# EAGLE schematic ASM2027-Rev3 (EAGLE 6.3)
DATABASE: ./../../../../../Components/TinyCircuits_Part_Database.txt
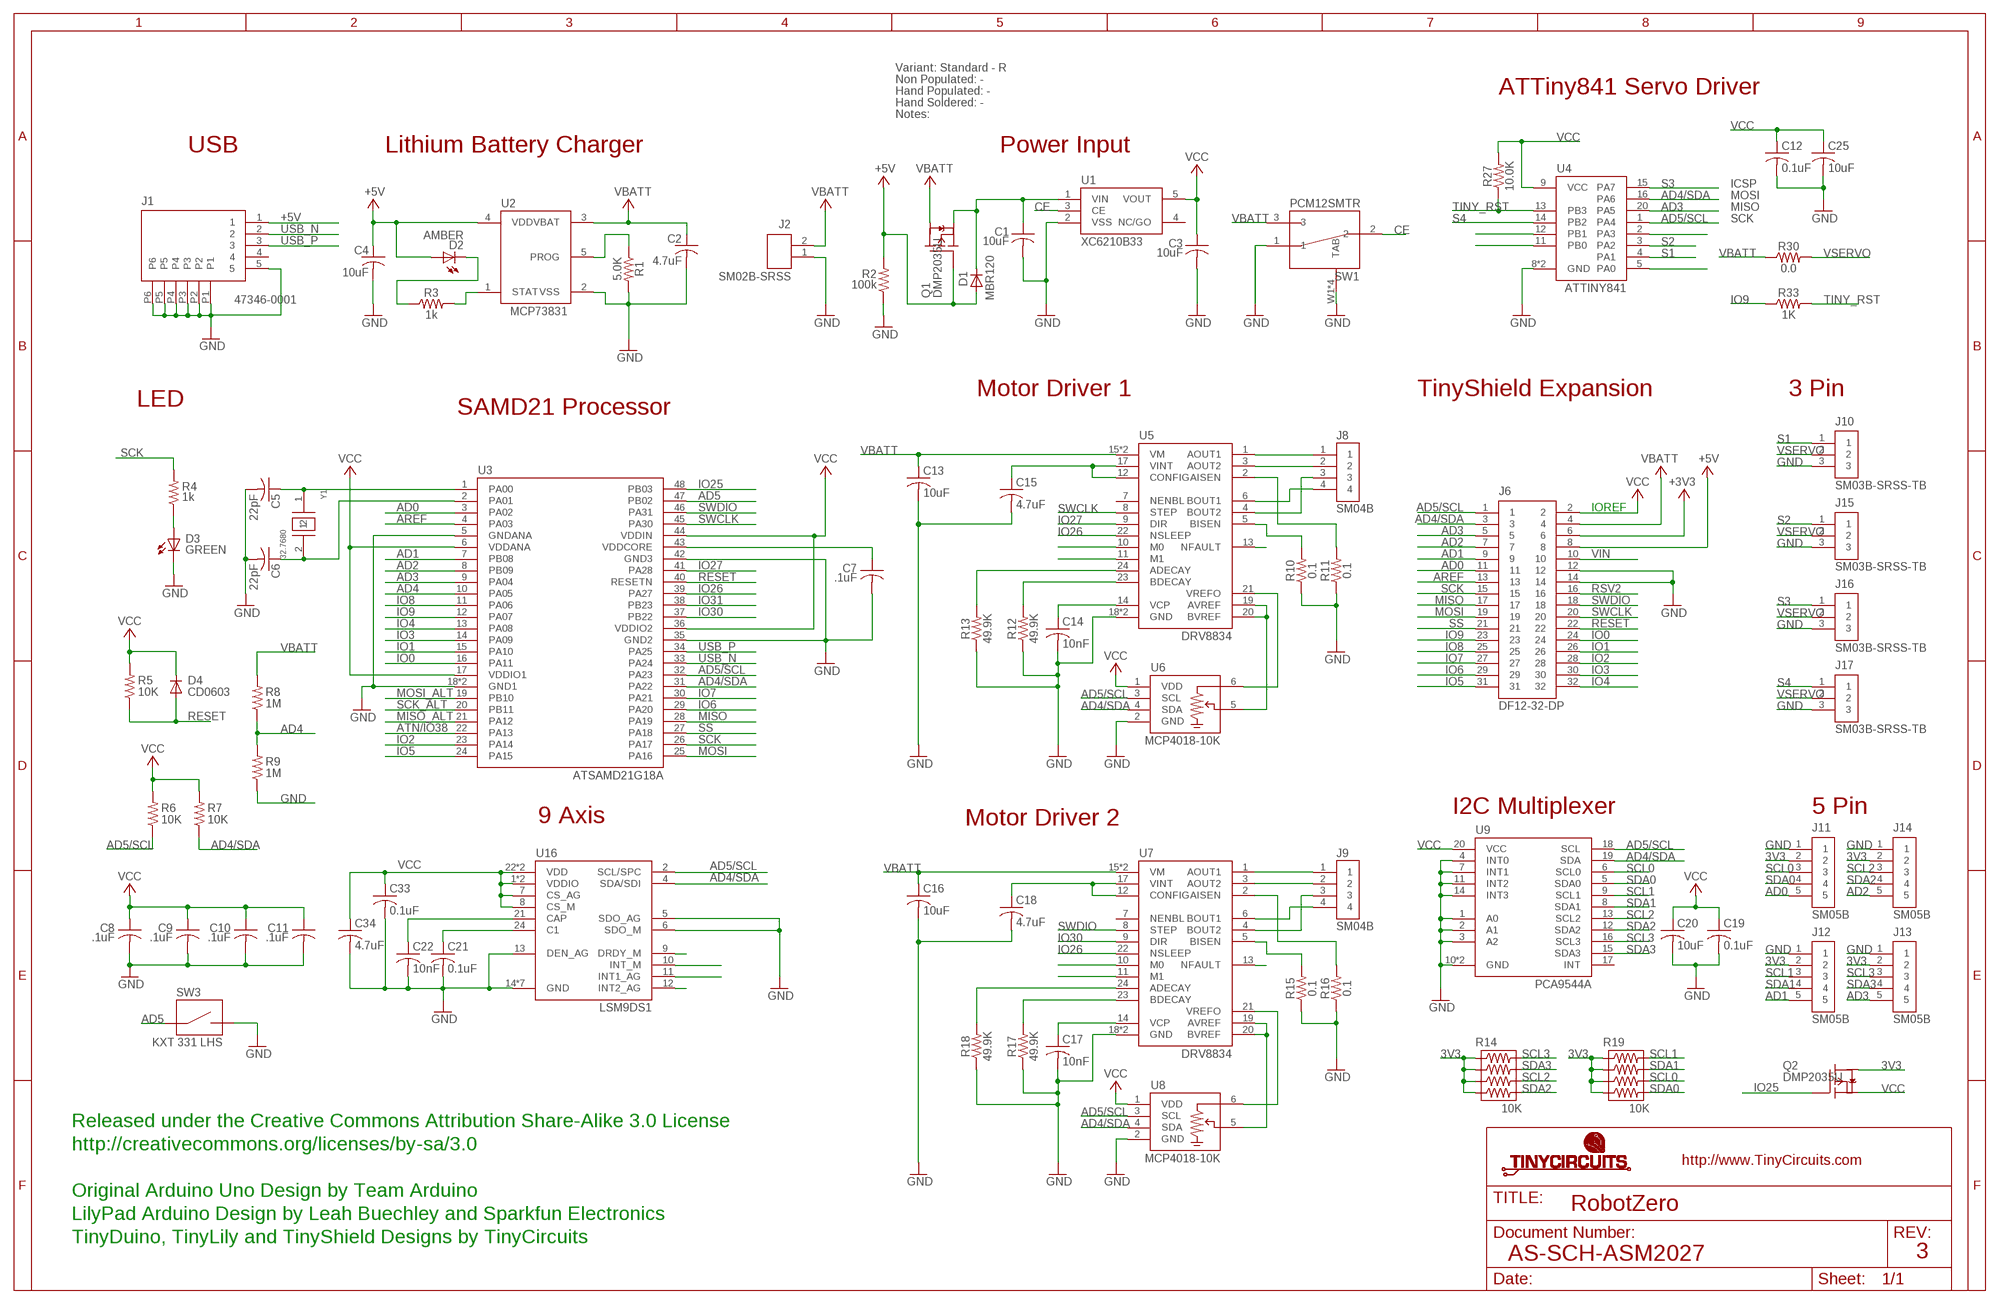
[diagram p0: schematic, sheet 1]

## Parts
C1  10uF  AS-ITM-00002  [C0603]
C2  4.7uF  AS-ITM-00088  [C0603]
C3  10uF  AS-ITM-00002  [C0603]
C4  10uF  AS-ITM-00002  [C0603]
C5  22pF  AS-ITM-00211  [C0402]
C6  22pF  AS-ITM-00211  [C0402]
C7  .1uF  AS-ITM-00008  [C0402]
C8  .1uF  AS-ITM-00008  [C0402]
C9  .1uF  AS-ITM-00008  [C0402]
C10  .1uF  AS-ITM-00008  [C0402]
C11  .1uF  AS-ITM-00008  [C0402]
C12  0.1uF  AS-ITM-00008  [C0402]
C13  10uF  AS-ITM-00002  [C0603]
C14  10nF  AS-ITM-00084  [C0402]
C15  4.7uF  AS-ITM-00242  [C0402]
C16  10uF  AS-ITM-00002  [C0603]
C17  10nF  AS-ITM-00084  [C0402]
C18  4.7uF  AS-ITM-00242  [C0402]
C19  0.1uF  AS-ITM-00008  [C0402]
C20  10uF  AS-ITM-00002  [C0603]
C21  0.1uF  AS-ITM-00008  [C0402]
C22  10nF  AS-ITM-00084  [C0402]
C25  10uF  AS-ITM-00045  [C0805]
C33  0.1uF  AS-ITM-00008  [C0402]
C34  4.7uF  AS-ITM-00242  [C0402]
D1  MBR120  AS-ITM-00111  [SOD-123FL]
D2  AMBER  AS-ITM-00058  [0402_LED]
D3  GREEN  AS-ITM-00011  [LNJ_LED]
D4  CD0603  AS-ITM-00009  [0603]
J1  47346-0001  AS-ITM-00021  [MICRO_USB]
J2  SM02B-SRSS  AS-ITM-00231  [JST_SH_2X1]
J6  DF12-32-DP  AS-ITM-00015  [DF12-32-DP]
J8  SM04B  AS-ITM-00395  [JST_SH_4X1]
J9  SM04B  AS-ITM-00395  [JST_SH_4X1]
J10  SM03B-SRSS-TB  AS-ITM-00471  [JST_SH_3X1_VERT]
J11  SM05B  AS-ITM-00391  [JST_SH_5X1_VERT]
J12  SM05B  AS-ITM-00391  [JST_SH_5X1_VERT]
J13  SM05B  AS-ITM-00391  [JST_SH_5X1_VERT]
J14  SM05B  AS-ITM-00391  [JST_SH_5X1_VERT]
J15  SM03B-SRSS-TB  AS-ITM-00471  [JST_SH_3X1_VERT]
J16  SM03B-SRSS-TB  AS-ITM-00471  [JST_SH_3X1_VERT]
J17  SM03B-SRSS-TB  AS-ITM-00471  [JST_SH_3X1_VERT]
Q1  DMP2035U  AS-ITM-00024A  [SOT23A]
Q2  DMP2035U  AS-ITM-00024A  [SOT23A]
R1  5.0K  AS-ITM-00289  [0402]
R2  100k  AS-ITM-00004  [0402]
R3  1k  AS-ITM-00003  [0402]
R4  1k  AS-ITM-00003  [0402]
R5  10K  AS-ITM-00032  [0402]
R6  10K  AS-ITM-00032  [0402]
R7  10K  AS-ITM-00032  [0402]
R8  1M  AS-ITM-00005  [0402]
R9  1M  AS-ITM-00005  [0402]
R10  0.1  AS-ITM-00157  [R0805]
R11  0.1  AS-ITM-00157  [R0805]
R12  49.9K  AS-ITM-00074  [0402]
R13  49.9K  AS-ITM-00074  [0402]
R14  10K  AS-ITM-00520  [0402RPACK]
R15  0.1  AS-ITM-00157  [R0805]
R16  0.1  AS-ITM-00157  [R0805]
R17  49.9K  AS-ITM-00074  [0402]
R18  49.9K  AS-ITM-00074  [0402]
R19  10K  AS-ITM-00520  [0402RPACK]
R27  10.0K  AS-ITM-00032  [0402]
R30  0.0  AS-ITM-00076  [0402]
R33  1K  AS-ITM-00003  [0402]
SW1  PCM12SMTR  AS-ITM-00220  [PCM12SMTR]
SW3  KXT 331 LHS  AS-ITM-00372  [KXT_LHS]
U1  XC6210B33  AS-ITM-00046  [SOT-25]
U2  MCP73831  AS-ITM-00136  [SOT-23]
U3  ATSAMD21G18A  AS-ITM-00273  [QFN48]
U4  ATTINY841  AS-ITM-00255  [VQFN-20]
U5  DRV8834  AS-ITM-00392  [VQFN-24_4X4]
U6  MCP4018-10K  AS-ITM-00393  [SOT-353-6]
U7  DRV8834  AS-ITM-00392  [VQFN-24_4X4]
U8  MCP4018-10K  AS-ITM-00393  [SOT-353-6]
U9  PCA9544A  AS-ITM-00342  [VQFN-20_4.5X3.5]
U16  LSM9DS1  AS-ITM-00265  [LGA-24]
Y1  32.7680  AS-ITM-00279  [ABS06]

## Nets
3V3: J11.2 J12.2 J13.2 J14.2 Q2.C(D) R14.1 R14.3 R14.5 R14.7 R19.1 R19.3 R19.5 R19.7
+3V3: J6.6
+5V: C4.1 D1.A D2.1(A) J1.1 J6.8 Q1.B(G) R2.2 U2.4(VDD)
AD0: J6.11 J11.5 U3.3(PA02)
AD1: J6.9 J12.5 U3.7(PB08)
AD2: J6.7 J14.5 U3.8(PB09)
AD3: J6.5 J13.5 U3.9(PA04) U4.20(PA5)
AD4: R8.1 R9.2 U3.10(PA05)
AD4/SDA: J6.3 R7.1 U3.31(PA22) U4.16(PA6) U6.4(SDA) U8.4(SDA) U9.19(SDA) U16.4(SDA/SDI)
AD5: SW3.1 U3.47(PB02)
AD5/SCL: J6.1 R6.1 U3.32(PA23) U4.1(PA4) U6.3(SCL) U8.3(SCL) U9.18(SCL) U16.2(SCL/SPC)
AOUT1: J8.1 U5.1(AOUT1)
AOUT2: J8.2 U5.3(AOUT2)
AOUT3: J9.1 U7.1(AOUT1)
AREF: J6.13 U3.4(PA03)
ATN/IO38: U3.22(PA13)
BOUT1: J8.4 U5.6(BOUT1)
BOUT2: J8.3 U5.4(BOUT2)
BOUT3: J9.4 U7.6(BOUT1)
BOUT4: J9.3 U7.4(BOUT2)
CE: SW1.2 U1.3(CE)
GND: C1.2 C2.2 C3.2 C4.2 C5.2 C6.2 C7.2 C8.2 C9.2 C10.2 C11.2 C12.2 C13.2 C14.2 C15.2 C16.2 C17.2 C18.2 C19.2 C20.2 C21.2 C22.2 C25.2 C33.2 C34.2 D3.C J1.5 J1.P1 J1.P2 J1.P3 J1.P4 J1.P5 J1.P6 J2.1 J6.12 J6.14 J10.3 J11.1 J12.1 J13.1 J14.1 J15.3 J16.3 J17.3 R1.2 R2.1 R9.1 R10.1 R11.1 R12.1 R13.1 R15.1 R16.1 R17.1 R18.1 SW1.1 SW1.W1(TAB) SW1.W2(TAB) SW1.W3(TAB) SW1.W4(TAB) SW3.2 U1.2(VSS) U2.2(VSS) U3.5(GNDANA) U3.18(GND1) U3.35(GND2) U3.42(GND3) U3.EXP(GND1) U4.8(GND) U4.PAD(GND) U5.18(GND) U5.PAD(GND) U6.2(GND) U7.18(GND) U7.PAD(GND) U8.2(GND) U9.1(A0) U9.2(A1) U9.3(A2) U9.4(INT0) U9.7(INT1) U9.10(GND) U9.11(INT2) U9.14(INT3) U9.PAD(GND) U16.5(SDO_AG) U16.6(SDO_M) U16.13(DEN_AG) U16.14(GND) U16.15(GND) U16.16(GND) U16.17(GND) U16.18(GND) U16.19(GND) U16.20(GND)
IO0: J6.24 U3.16(PA11)
IO1: J6.26 U3.15(PA10)
IO2: J6.28 U3.23(PA14)
IO3: J6.30 U3.14(PA09)
IO4: J6.32 U3.13(PA08)
IO5: J6.31 U3.24(PA15)
IO6: J6.29 U3.29(PA20)
IO7: J6.27 U3.30(PA21)
IO8: J6.25 U3.11(PA06)
IO9: J6.23 R33.1 U3.12(PA07)
IO25: Q2.B(G) U3.48(PB03)
IO26: U3.39(PA27) U5.22(NSLEEP) U7.22(NSLEEP)
IO27: U3.41(PA28) U5.9(DIR)
IO30: U3.37(PB22) U7.9(DIR)
IO31: U3.38(PB23)
MISO: J6.17 U3.28(PA19)
MISO_ALT: U3.21(PA12)
MOSI: J6.19 U3.25(PA16)
MOSI_ALT: U3.19(PB10)
N$1: C5.1 U3.1(PA00) Y1.1
N$2: U4.11(PB0)
N$3: C6.1 U3.2(PA01) Y1.2
N$4: D3.A R4.1
N$5: D2.2(C) R3.1
N$6: R1.1 U2.5(PROG)
N$7: R3.2 U2.1(STAT)
N$8: C7.1 U3.43(VDDCORE)
N$9: R10.2 U5.5(BISEN)
N$10: R11.2 U5.2(AISEN)
N$11: U5.19(AVREF) U5.20(BVREF) U6.5(W)
N$12: U5.21(VREFO) U6.6(A)
N$13: U4.12(PB1)
N$14: C14.1 U5.14(VCP)
N$15: R12.2 U5.23(BDECAY)
N$16: R13.2 U5.24(ADECAY)
N$17: U5.11(M1)
N$18: U5.10(M0)
N$20: U4.2(PA3)
N$21: J9.2 U7.3(AOUT2)
N$22: U4.5(PA0)
N$23: U5.13(NFAULT)
N$24: C15.1 U5.12(CONFIG) U5.17(VINT)
N$27: R15.2 U7.5(BISEN)
N$28: R16.2 U7.2(AISEN)
N$29: U7.19(AVREF) U7.20(BVREF) U8.5(W)
N$30: U7.21(VREFO) U8.6(A)
N$31: C17.1 U7.14(VCP)
N$32: R17.2 U7.23(BDECAY)
N$33: R18.2 U7.24(ADECAY)
N$34: U7.11(M1)
N$35: U7.10(M0)
N$40: U7.13(NFAULT)
N$41: C18.1 U7.12(CONFIG) U7.17(VINT)
N$52: C22.1 U16.21(CAP)
N$53: C21.1 U16.24(C1)
N$59: U16.9(DRDY_M)
N$60: U16.10(INT_M)
N$61: U16.11(INT1_AG)
N$62: U16.12(INT2_AG)
RESET: D4.A J6.22 R5.1 U3.40(RESETN)
RSV2: J6.16
S1: J10.1 U4.4(PA1)
S2: J15.1 U4.3(PA2)
S3: J16.1 U4.15(PA7)
S4: J17.1 U4.14(PB2)
SCK: J6.15 R4.2 U3.26(PA17)
SCK_ALT: U3.20(PB11)
SCL0: J11.3 R19.6 U9.6(SCL0)
SCL1: J12.3 R19.2 U9.9(SCL1)
SCL2: J14.3 R14.6 U9.13(SCL2)
SCL3: J13.3 R14.2 U9.16(SCL3)
SDA0: J11.4 R19.8 U9.5(SDA0)
SDA1: J12.4 R19.4 U9.8(SDA1)
SDA2: J14.4 R14.8 U9.12(SDA2)
SDA3: J13.4 R14.4 U9.15(SDA3)
SS: J6.21 U3.27(PA18)
SWCLK: J6.20 U3.45(PA30) U5.8(STEP)
SWDIO: J6.18 U3.46(PA31) U7.8(STEP)
TINY_RST: R27.1 R33.2 U4.13(PB3)
USB_N: J1.2 U3.33(PA24)
USB_P: J1.3 U3.34(PA25)
VBATT: C2.1 C13.1 C16.1 J2.2 J6.4 Q1.C(D) R8.2 R30.1 SW1.3 U2.3(VBAT) U5.15(VM) U5.16(VM) U7.15(VM) U7.16(VM)
VCC: C3.1 C8.1 C9.1 C10.1 C11.1 C12.1 C19.1 C20.1 C25.1 C33.1 C34.1 D4.C J6.2 Q2.E(S) R5.2 R6.2 R7.2 R27.2 U1.5(VOUT) U3.6(VDDANA) U3.17(VDDIO1) U3.36(VDDIO2) U3.44(VDDIN) U4.9(VCC) U6.1(VDD) U8.1(VDD) U9.20(VCC) U16.1(VDDIO) U16.3(VDDIO) U16.7(CS_AG) U16.8(CS_M) U16.22(VDD) U16.23(VDD)
VCC_IN: C1.1 D1.C Q1.E(S) U1.1(VIN)
VIN: J6.10
VSERVO: J10.2 J15.2 J16.2 J17.2 R30.2
Unconnected: J1.4 U1.4(NC/GO) U5.7(NENBL) U7.7(NENBL) U9.17(INT)

## Notes on the sheet
- Variant: Standard - R
- Non Populated: -
- Hand Populated: - | ATTiny841 Servo Driver
- Hand Soldered: -
- Notes:
- USB | Lithium Battery Charger | Power Input
- ICSP
- MOSI
- MISO
- SCK
- Motor Driver 1 | TinyShield Expansion | 3 Pin
- LED
- SAMD21 Processor
- IOREF
- I2C Multiplexer | 5 Pin
- 9 Axis | Motor Driver 2
- Released under the Creative Commons Attribution Share-Alike 3.0 License
- http://creativecommons.org/licenses/by-sa/3.0
- Original Arduino Uno Design by Team Arduino
- RobotZero
- LilyPad Arduino Design by Leah Buechley and Sparkfun Electronics
- TinyDuino, TinyLily and TinyShield Designs by TinyCircuits
- AS-SCH-ASM2027 | 3

## Library data of the parts
C1 C3 C4 C13 C16 C20 = tinycircuits:AS-ITM-00002: CAP CER 10UF 10V 20% X5R 0603; PARTNO: AS-ITM-00002
C2 = tinycircuits:AS-ITM-00088: CAP CER 4.7UF 6.3V 20% X5R 0603; PARTNO: AS-ITM-00088
C5 C6 = tinycircuits:AS-ITM-00211: CAP CER 22PF 50V 2% NP0 0402; PARTNO: AS-ITM-00211
C7-C11 = tinycircuits:AS-ITM-00008: CAP CER 0.1UF 16V 10% X5R 0402; PARTNO: AS-ITM-00008; VALUE: 0.1uF
C12 C19 C21 C33 = tinycircuits:AS-ITM-00008: CAP CER 0.1UF 16V 10% X5R 0402; PARTNO: AS-ITM-00008
C14 C17 C22 = tinycircuits:AS-ITM-00084: CAP CER 10NF 25V 10% X7R 0402; PARTNO: AS-ITM-00084
C15 C18 C34 = tinycircuits:AS-ITM-00242: CAP CER 4.7UF 6.3V 20% X5R 0402; PARTNO: AS-ITM-00242
C25 = tinycircuits:AS-ITM-00045: CAP CER 16UF 16V 20% X5R 0805; PARTNO: AS-ITM-00045
D1 = tinycircuits:AS-ITM-00111: DIODE SCHOTTKY 20V 1A SOD123L; PARTNO: AS-ITM-00111; PNPROTATION: 0; VALUE: MBR120VLSFT1G
D2 = tinycircuits:AS-ITM-00058: LED 0402 AMBER WTR CLR SMD; PARTNO: AS-ITM-00058
D3 = tinycircuits:AS-ITM-00011: LED GREEN SIDE VIEW SMD; PARTNO: AS-ITM-00011; PNPROTATION: 90
D4 = tinycircuits:AS-ITM-00009: Diodes (General Purpose, Power, Switching) IO=150mA VR=75V HIGH SPEED; PARTNO: AS-ITM-00009; PNPROTATION: 0
J1 = tinycircuits:AS-ITM-00021: CONN RCPT 5POS MICRO USB R/A; PARTNO: AS-ITM-00021; PNPROTATION: 90
J2 = tinycircuits:AS-ITM-00231: CONN HEADER SH 2POS SIDE 1MM; PARTNO: AS-ITM-00231; PNPROTATION: 180; VALUE: SM02B-SRSS-TB(LF)(SN)
J6 = tinycircuits:AS-ITM-00015: CONN HEADER 32POS 3MM SMD 0.5MM; PARTNO: AS-ITM-00015; PNPROTATION: 0
J8 J9 = tinycircuits:AS-ITM-00395: CONN HEADER SH 4POS SIDE 1MM TIN; PARTNO: AS-ITM-00395; VALUE: SM05B
J10 J15-J17 = tinycircuits:AS-ITM-00471: CONN HEADER SH 3POS TOP 1MM TIN; PARTNO: AS-ITM-00471; VALUE: BM03B-SRSS-TB(LF)(SN)
J11-J14 = tinycircuits:AS-ITM-00391: CONN HEADER SH 5POS TOP 1MM TIN; PARTNO: AS-ITM-00391; PNPROTATION: 0; VALUE: BM05B
Q1 Q2 = tinycircuits:AS-ITM-00024: P-Channel MOSFET SOT-23; PARTNO: AS-ITM-00024; PNPROTATION: 0
R1 = tinycircuits:AS-ITM-00289: RES SMD 5.0K OHM 1% 1/16W 0402; PARTNO: AS-ITM-00289; VALUE: 5K
R2 = tinycircuits:AS-ITM-00004: RES 100K OHM 1/16W 1% 0402; PARTNO: AS-ITM-00004; VALUE: 100K
R3 R4 R33 = tinycircuits:AS-ITM-00003: RES 1.00K OHM 1/16W 1% 0402; PARTNO: AS-ITM-00003; VALUE: 1.00K
R5-R7 = tinycircuits:AS-ITM-00032: RES 10.0K OHM 1/16W 1% 0402 SMD; PARTNO: AS-ITM-00032; VALUE: 10.0K
R8 R9 = tinycircuits:AS-ITM-00005: RES 1.00M OHM 1/16W 1% 0402; PARTNO: AS-ITM-00005; VALUE: 1.00M
R10 R11 R15 R16 = tinycircuits:AS-ITM-00157: RES 0.1 OHM 0.25W 1% 0805 SMD; PARTNO: AS-ITM-00157
R12 R13 R17 R18 = tinycircuits:AS-ITM-00074: RES 49.9K OHM 1/16W 1% 0402 SMD; PARTNO: AS-ITM-00074
R14 R19 = tinycircuits:AS-ITM-00520: RES ARRAY 4 RES 10K OHM 0804; PARTNO: AS-ITM-00520
R27 = tinycircuits:AS-ITM-00032: RES 10.0K OHM 1/16W 1% 0402 SMD; PARTNO: AS-ITM-00032
R30 = tinycircuits:AS-ITM-00076: RES 0.0 OHM 1/16W 1% 0402 SMD; PARTNO: AS-ITM-00076
SW1 = tinycircuits:AS-ITM-00220: SW SLIDE SP2T 6VDC 0.3A SMT; PARTNO: AS-ITM-00220; PNPROTATION: 0
SW3 = tinycircuits:AS-ITM-00372: SWITCH TACTILE SPST-NO 0.02A 15V; PARTNO: AS-ITM-00372
U1 = tinycircuits:AS-ITM-00046: IC REG LDO 3.3V .7A SOT-25; PARTNO: AS-ITM-00046; PNPROTATION: 270
U2 = tinycircuits:AS-ITM-00136: IC CONTROLLER LI-ION 4.2V SOT23-5; PARTNO: AS-ITM-00136; PNPROTATION: 270
U3 = tinycircuits:AS-ITM-00273: IC MCU 32BIT 256KB FLASH 48QFN; PARTNO: AS-ITM-00273; PNPROTATION: 270
U4 = tinycircuits:AS-ITM-00255: IC MCU 8BIT 8KB FLASH 20VQFN; PARTNO: AS-ITM-00255; PNPROTATION: 0
U5 U7 = tinycircuits:AS-ITM-00392: IC MOTOR DRIVER PAR 24VQFN; PARTNO: AS-ITM-00392; PNPROTATION: 0
U6 U8 = tinycircuits:AS-ITM-00393: IC DGTL POT 10K 128TAPS SC70-6; PARTNO: AS-ITM-00393; PNPROTATION: 90
U9 = tinycircuits:AS-ITM-00342: IC I2C MUX 4CH BI-DIR 20-VQFN; PARTNO: AS-ITM-00342; PNPROTATION: 0
U16 = tinycircuits:AS-ITM-00265: 9 AXIS ACCEL GYRO MAG 3D INEMO 24TFLGA; PARTNO: AS-ITM-00265; PNPROTATION: 0
Y1 = tinycircuits:AS-ITM-00279: Crystal 32.7680kHz 20ppm 12.5pF; PARTNO: AS-ITM-00279; PNPROTATION: 0